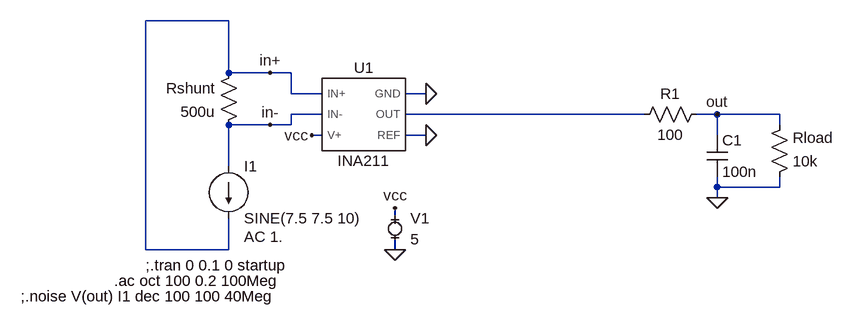
[diagram p0: schematic ina211-test.asc]
ina211-test.asc, the LTspice schematic file:
Version 4
SHEET 1 880 680
WIRE -448 -112 -576 -112
WIRE -448 -32 -448 -112
WIRE -384 -32 -448 -32
WIRE -352 -32 -384 -32
WIRE -352 0 -352 -32
WIRE -304 0 -352 0
WIRE -144 0 -176 0
WIRE -304 32 -352 32
WIRE 192 32 -176 32
WIRE 304 32 272 32
WIRE 400 32 304 32
WIRE -384 48 -448 48
WIRE -352 48 -352 32
WIRE -352 48 -384 48
WIRE 400 48 400 32
WIRE -304 64 -320 64
WIRE -144 64 -176 64
WIRE 304 64 304 32
WIRE -448 112 -448 48
WIRE 304 144 304 128
WIRE 400 144 400 128
WIRE 400 144 304 144
WIRE 304 160 304 144
WIRE -192 192 -192 176
WIRE -576 240 -576 -112
WIRE -448 240 -448 192
WIRE -448 240 -576 240
WIRE -192 240 -192 224
FLAG -192 240 0
FLAG -192 176 vcc
FLAG -384 -32 in+
FLAG -384 48 in-
FLAG -320 64 vcc
FLAG -144 0 0
FLAG -144 64 0
FLAG 304 160 0
FLAG 304 32 out
SYMBOL AutoGenerated\\INA211 -240 32 R0
SYMATTR InstName U1
SYMBOL MiniSyms4\\voltage- -192 208 R0
WINDOW 123 0 0 Left 0
WINDOW 39 0 0 Left 0
SYMATTR InstName V1
SYMATTR Value 5
SYMBOL current -448 112 R0
WINDOW 123 24 108 Left 2
WINDOW 39 0 0 Left 0
SYMATTR Value2 AC 1.
SYMATTR InstName I1
SYMATTR Value SINE(7.5 7.5 10)
SYMBOL res -432 -48 M0
SYMATTR InstName Rshunt
SYMATTR Value 500u
SYMATTR SpiceLine tol=5 pwr=3
SYMBOL res 288 16 R90
WINDOW 0 0 56 VBottom 2
WINDOW 3 32 56 VTop 2
SYMATTR InstName R1
SYMATTR Value 100
SYMBOL res 384 144 M180
WINDOW 0 36 76 Left 2
WINDOW 3 36 40 Left 2
SYMATTR InstName Rload
SYMATTR Value 10k
SYMBOL cap 288 64 R0
SYMATTR InstName C1
SYMATTR Value 100n
TEXT -576 264 Left 2 !;.tran 0 0.1 0 startup
TEXT -768 312 Left 2 !;.noise V(out) I1 dec 100 100 40Meg
TEXT -624 288 Left 2 !.ac oct 100 0.2 100Meg

The netlist it stands for:
* ina211-test.asc
XU1 in+ in- vcc 0 N001 0 INA211  ; pins IN+ IN- V+ GND OUT REF
V1 vcc 0 5
I1 in- in+ SINE(7.5 7.5 10) AC 1.
Rshunt in+ in- 500u tol=5 pwr=3
R1 out N001 100
Rload 0 out 10k
C1 out 0 100n
;.tran 0 0.1 0 startup
;.noise V(out) I1 dec 100 100 40Meg
.ac oct 100 0.2 100Meg
.lib C:\users\joaoantoniocardoso\Desktop\tina-spice\INA211_PSPICE_AIO\INA211.LIB
.backanno
.end

* Results of the author's LTspice run, read from the files saved beside the schematic
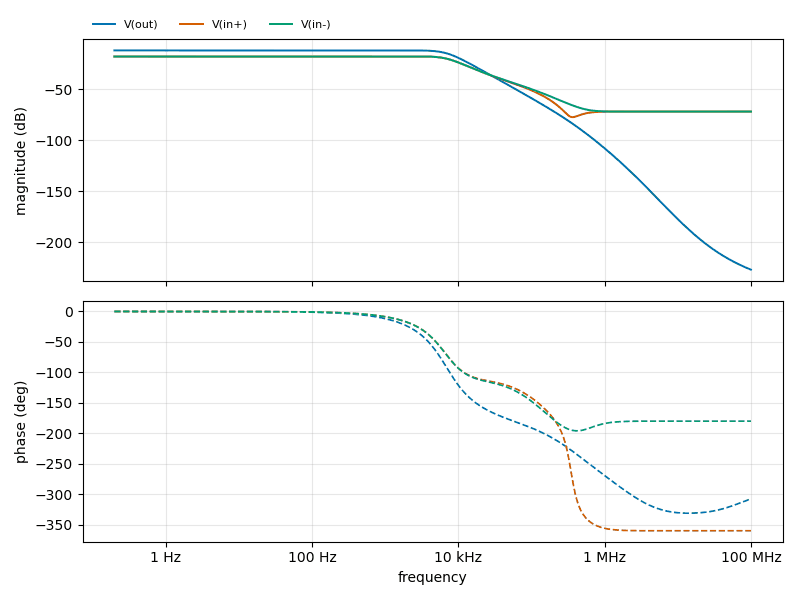
[diagram p1: AC Analysis of ina211-test.asc, plotted from the saved traces]
* AC Analysis, 1 run:
*   V(out): -12.14 dB at 200 mHz, -226.98 dB at 100 MHz, peak -12.13 dB at 1.616 kHz, 3 dB below the peak at 7.055 kHz
*   V(in+): -18.10 dB at 200 mHz, -72.05 dB at 100 MHz, peak -18.01 dB at 2.589 kHz, 3 dB below the peak at 7.637 kHz
*   V(in-): -18.14 dB at 200 mHz, -72.04 dB at 100 MHz, peak -18.04 dB at 2.625 kHz, 3 dB below the peak at 7.655 kHz